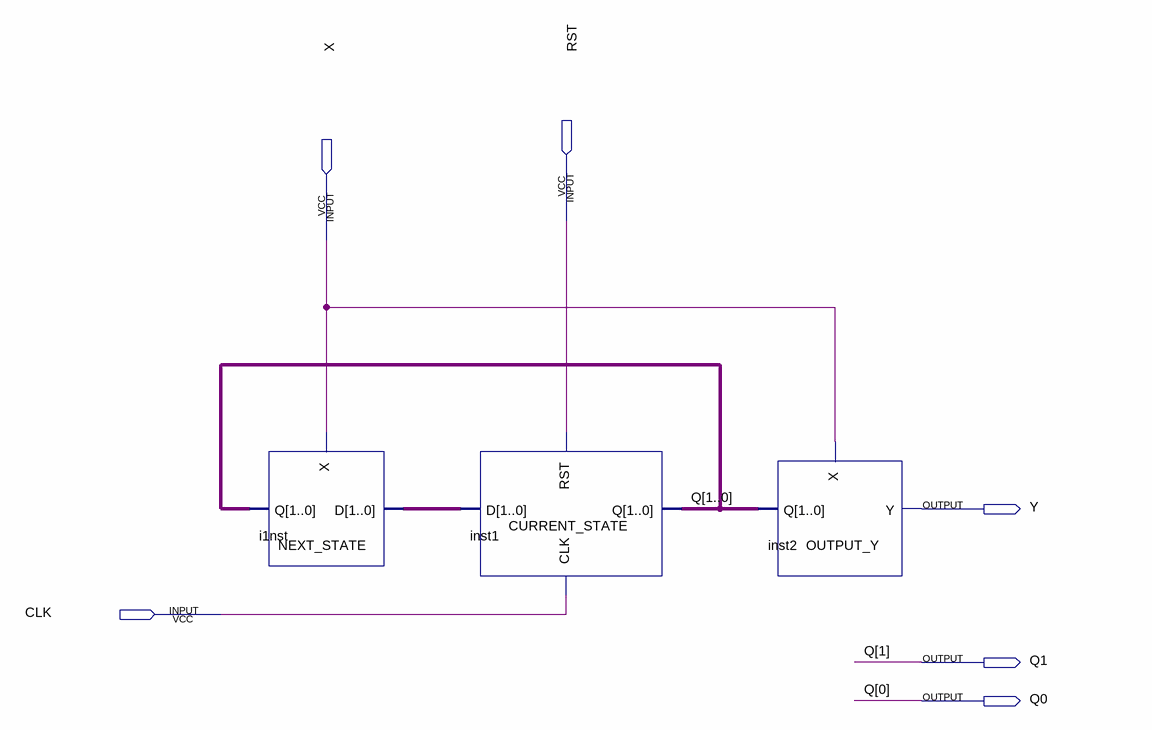
[diagram p0: schematic sheet]
// Quartus schematic BAI1.bdf as structural Verilog: 3 symbols, 6 pins
module BAI1 (
  input  RST,
  input  X,
  input  CLK,
  output Y,
  output Q1,
  output Q0
);

  wire [1:0] i1nst_d;

  NEXT_STATE i1nst (.X(X), .Q({Q1, Q0}), .D(i1nst_d));
  CURRENT_STATE inst1 (.D(i1nst_d), .CLK(CLK), .RST(RST), .Q({Q1, Q0}));
  OUTPUT_Y inst2 (.X(X), .Q({Q1, Q0}), .Y(Y));
endmodule
